# EAGLE design Atmega (EAGLE 6.3)
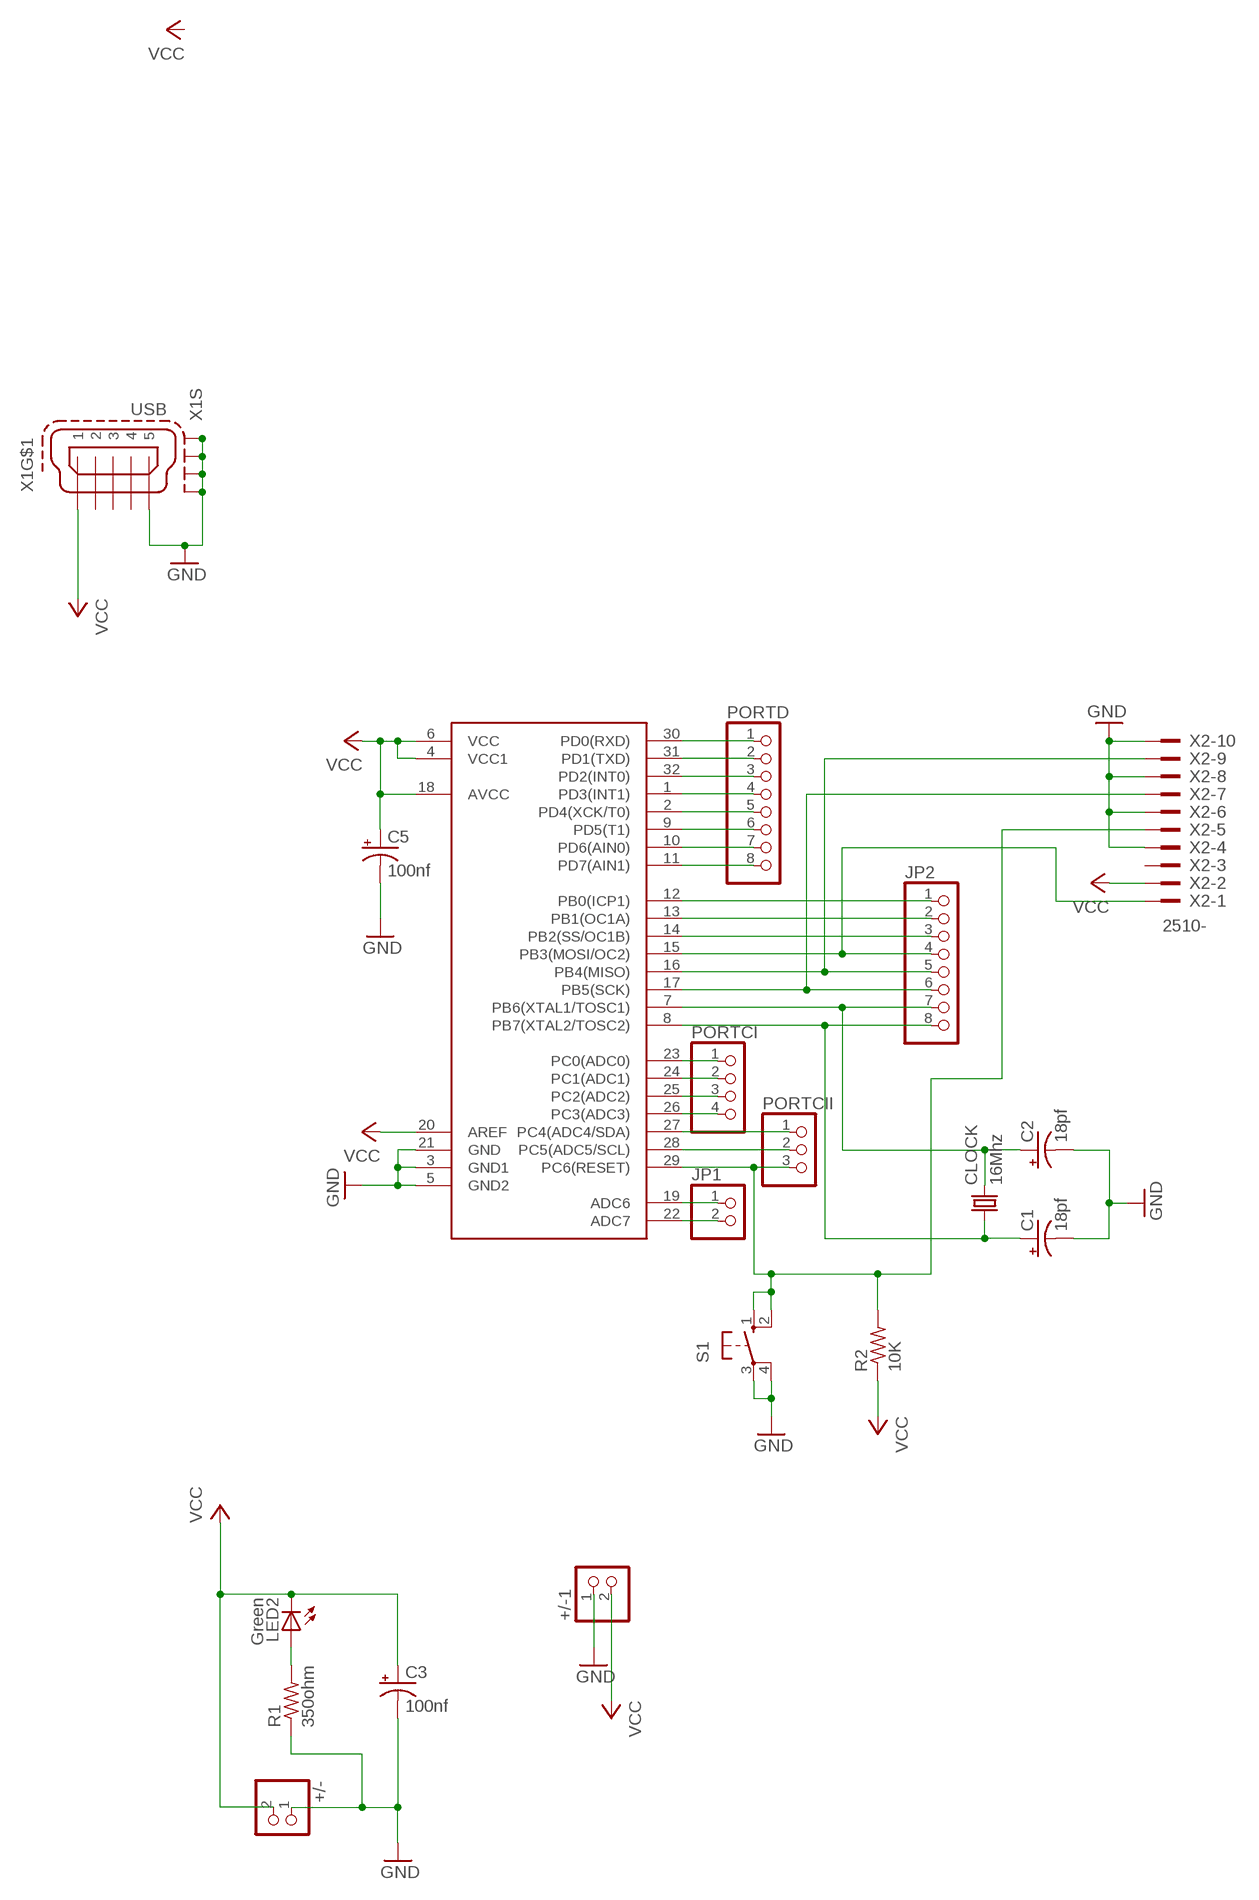
[diagram p0: schematic, sheet 1]

## Parts
+/-  PINHD-1X2  [1X02]
+/-1  PINHD-1X2  [1X02]
C1  18pf  CPOL-USSMCZ  [SMC_Z]
C2  18pf  CPOL-USSMCZ  [SMC_Z]
C3  100nf  CPOL-USSMCZ  [SMC_Z]
C5  100nf  CPOL-USSMCZ  [SMC_Z]
CLOCK  16Mhz  CRYSTALHC49UP  [HC49UP]
JP1  PINHD-1X2  [1X02]
JP2  PINHD-1X8  [1X08]
LED2  Green  LG_T679-E1F1-1  [PLCC2]
PORTCI  PINHD-1X4  [1X04]
PORTCII  PINHD-1X3  [1X03]
PORTD  PINHD-1X8  [1X08]
R1  350ohm  R-US_M0805  [M0805]
R2  10K  R-US_M0805  [M0805]
S1  10-XX  [B3F-10XX]
U$1  ATMEGA8A  [TQFP32-08]
X1  USB  MINI-USB-SCHIELD-32005-201  [32005-201]
X2  2510-  [PAK100/2500-10]

## Nets
GND: +/-1.1 +/-.1 C1.- C2.- C3.- C5.- R1.1 S1.3(P) S1.4(P1) U$1.3(GND1) U$1.5(GND2) U$1.21(GND) X1.5 X1.M1(S:S1) X1.M2(S:S2) X1.M3(S:S3) X1.M4(S:S4) X2.4 X2.6 X2.8 X2.10
N$4: LED2.A R1.2
N$5: PORTCI.1 U$1.23(PC0(ADC0))
N$6: PORTCI.2 U$1.24(PC1(ADC1))
N$8: PORTCI.3 U$1.25(PC2(ADC2))
N$9: PORTCI.4 U$1.26(PC3(ADC3))
N$10: PORTCII.1 U$1.27(PC4(ADC4/SDA))
N$11: PORTCII.2 U$1.28(PC5(ADC5/SCL))
N$12: PORTCII.3 R2.2 S1.1(S) S1.2(S1) U$1.29(PC6(RESET)) X2.5
N$13: JP2.1 U$1.12(PB0(ICP1))
N$14: JP2.2 U$1.13(PB1(OC1A))
N$15: JP2.3 U$1.14(PB2(SS/OC1B))
N$16: JP2.4 U$1.15(PB3(MOSI/OC2)) X2.1
N$17: JP2.5 U$1.16(PB4(MISO)) X2.9
N$18: JP2.6 U$1.17(PB5(SCK)) X2.7
N$19: C2.+ CLOCK.2 JP2.7 U$1.7(PB6(XTAL1/TOSC1))
N$20: C1.+ CLOCK.1 JP2.8 U$1.8(PB7(XTAL2/TOSC2))
N$22: PORTD.1 U$1.30(PD0(RXD))
N$23: PORTD.2 U$1.31(PD1(TXD))
N$25: PORTD.3 U$1.32(PD2(INT0))
N$26: PORTD.4 U$1.1(PD3(INT1))
N$27: PORTD.5 U$1.2(PD4(XCK/T0))
N$29: PORTD.6 U$1.9(PD5(T1))
N$30: PORTD.7 U$1.10(PD6(AIN0))
N$31: PORTD.8 U$1.11(PD7(AIN1))
N$32: JP1.1 U$1.19(ADC6)
N$33: JP1.2 U$1.22(ADC7)
VCC: +/-1.2 +/-.2 C3.+ C5.+ LED2.C R2.1 U$1.4(VCC1) U$1.6(VCC) U$1.18(AVCC) U$1.20(AREF) X1.1 X2.2
Unconnected: X1.2 X1.3 X1.4 X2.3

## Library data of the parts
+/- +/-1 JP1 = pinhead:PINHD-1X2: PIN HEADER
C1-C3 C5 = rcl:CPOL-US: POLARIZED CAPACITOR, American symbol
CLOCK = crystal:CRYSTAL: CRYSTAL; OC_FARNELL: unknown; OC_NEWARK: unknown
JP2 PORTD = pinhead:PINHD-1X8: PIN HEADER
LED2 = led:*_T679-?-1: LC TOPLED® Low Current LED Source: http://catalog.osram-os.com .. LG_LS_LY_T679_OBS.pdf; COLOR: green
PORTCI = pinhead:PINHD-1X4: PIN HEADER
PORTCII = pinhead:PINHD-1X3: PIN HEADER
R1 R2 = rcl:R-US_: RESISTOR, American symbol
S1 = switch-omron:10-XX: OMRON SWITCH; MPN: B3F-1000; OC_FARNELL: 176432; OC_NEWARK: 36M3542
U$1 = atmel:ATMEGA8A
X1 = con-cypressindustries:MINI-USB-SCHIELD-: MINI USB-B Conector Source: www.cypressindustries.com; OC_FARNELL: unknown; OC_NEWARK: unknown
X2 = con-3m:2510-: 3M (TM) Pak 100 4-Wall Header Source: 3M; MF: 3M; MPN: 2510-6002UB; OC_FARNELL: 9838244; OC_NEWARK: 46F4725

## Board
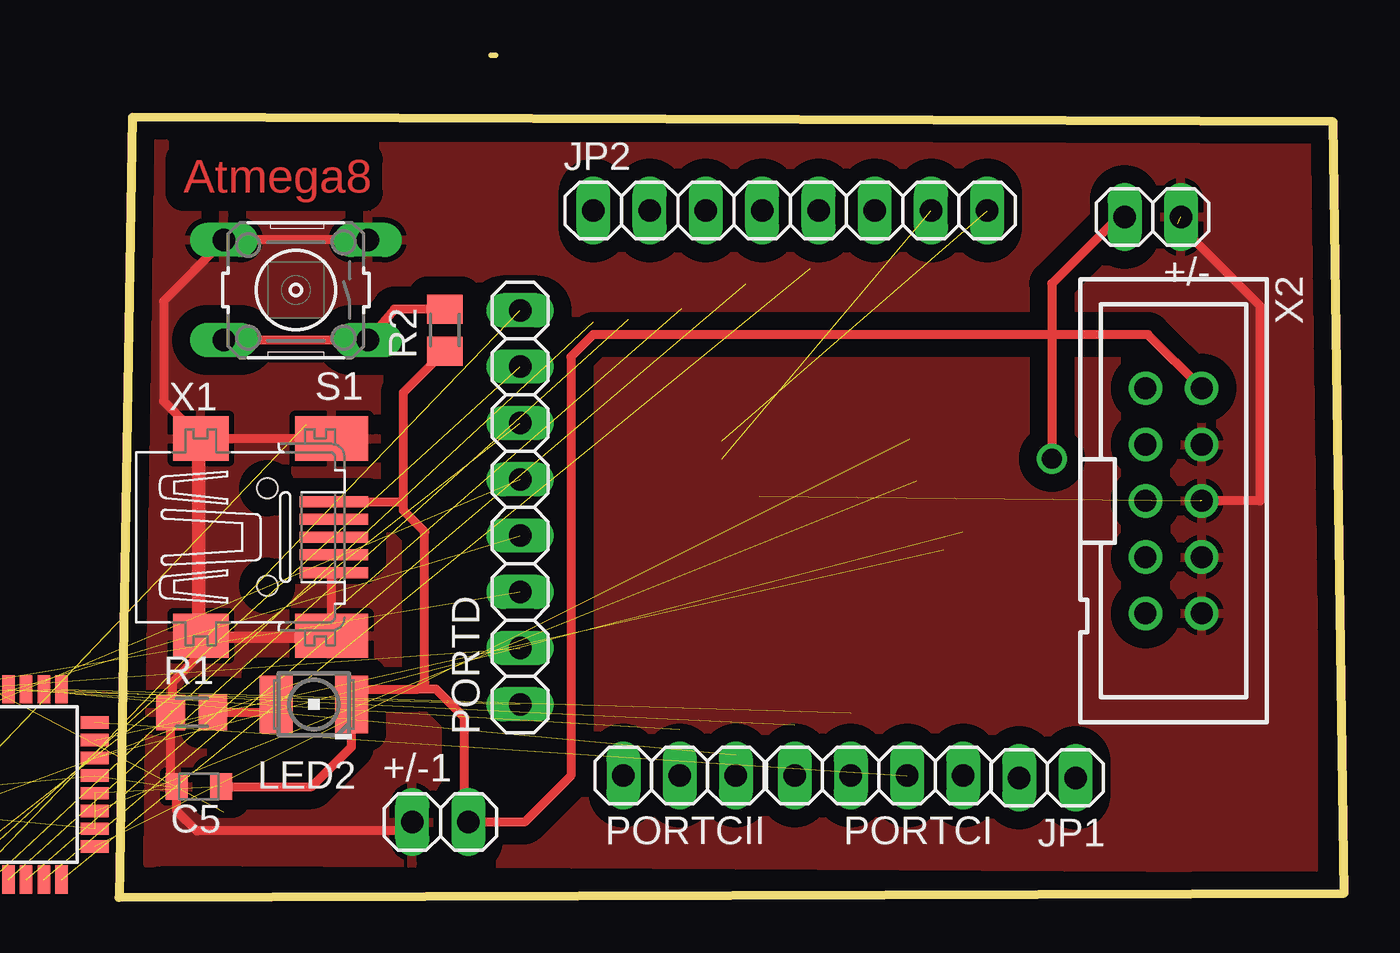
[diagram p1: board, top side]
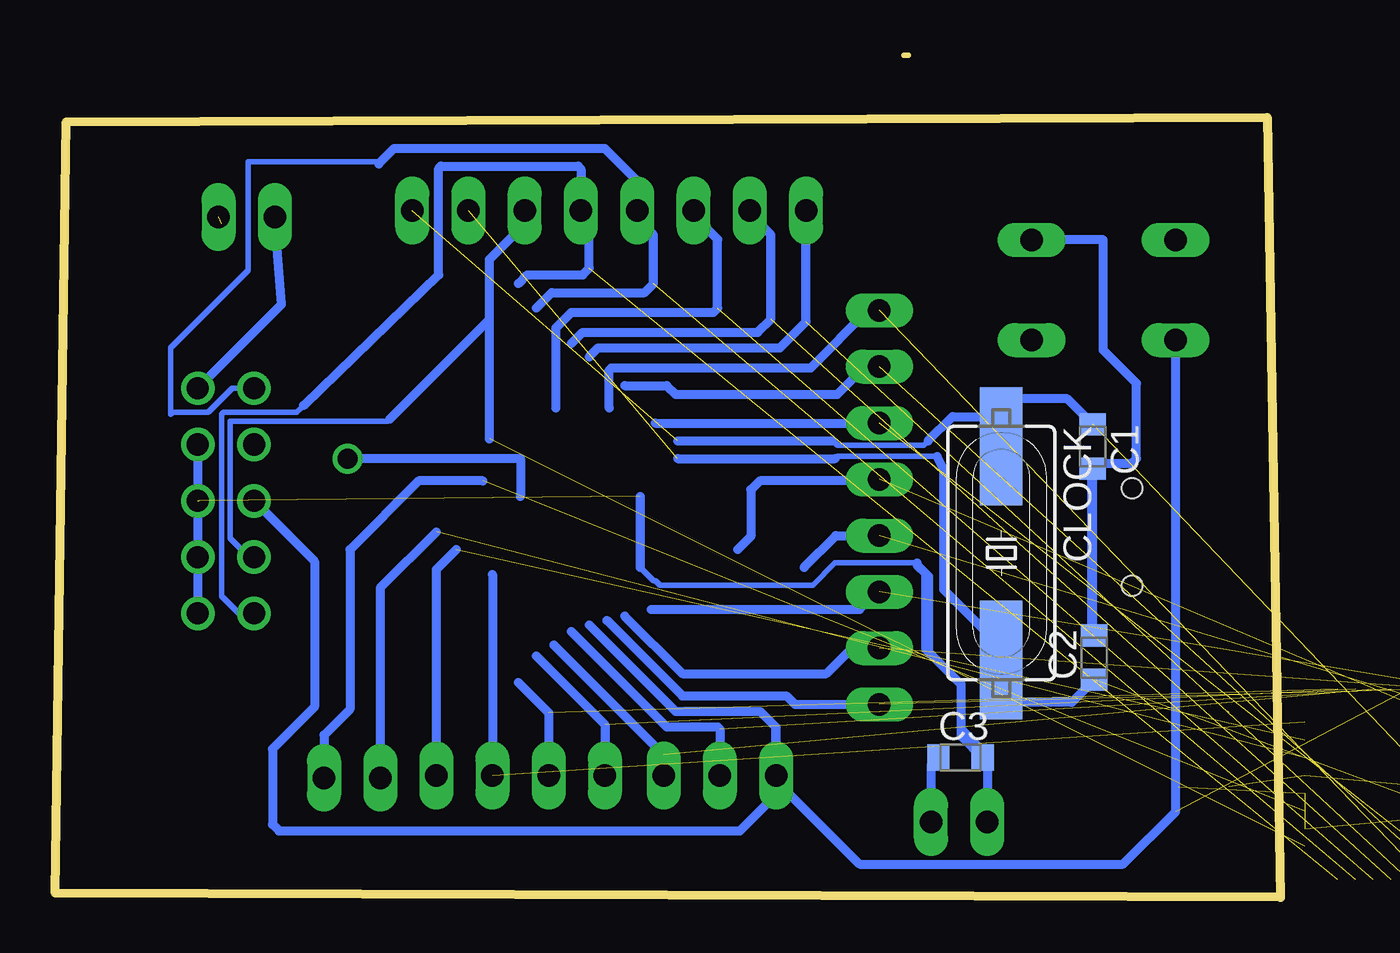
[diagram p2: board, bottom side, seen from below]

Size 55.3 x 38 mm. Coordinates in mm from the lower left corner, seen from the top.
Outline: 17,38 16.8,38
Outline: 0.6,35.2 0,0 55.3,0.2 54.8,35 0.6,35.2
Copper layers (1*16): Top 0.035mm / dielectric 1.5mm / Bottom 0.035mm
Design rules "default": minimum track width 10mil, minimum drill 24mil, track to track 4mil, track to pad 4mil, pad to pad 8mil, via to via 8mil, smd to smd 8mil, copper to edge 10mil, drill to drill 8mil, minimum pad ring 10mil, minimum via ring 8mil, stop-mask expansion 4mil, vias tented up to drill 0mil, thermal gap 10mil

### Footprints (pad centres in the part's own frame; a part is rotated, then mirrored left to right if it is on the bottom)
1X02 = drill 1.016 long: 1 -1.27,0; 2 1.27,0
SMC_Z = smd 1 x 1.2: + -1,0; - 1,0
HC49UP = smd 5.334 x 1.93: 1 -4.826,0; 2 4.826,0
1X08 = drill 1.016 long: 1 -8.89,0; 2 -6.35,0; 3 -3.81,0; 4 -1.27,0; 5 1.27,0; 6 3.81,0; 7 6.35,0; 8 8.89,0
PLCC2 = smd 2.6 x 1.5: A 0,1.7; C 0,-1.7
1X04 = drill 1.016 long: 1 -3.81,0; 2 -1.27,0; 3 1.27,0; 4 3.81,0
1X03 = drill 1.016 long: 1 -2.54,0; 2 0,0; 3 2.54,0
M0805 = smd 1.3 x 1.6: 1 -0.95,0; 2 0.95,0
B3F-10XX = drill 1.016 long: 1 -3.251,2.261; 2 3.251,2.261; 3 -3.251,-2.261; 4 3.251,-2.261
TQFP32-08 = smd 1.27 x 0.559: 1 -4.293,2.8; 2 -4.293,2; 3 -4.293,1.2; 4 -4.293,0.4; 5 -4.293,-0.4; 6 -4.293,-1.2; 7 -4.293,-2; 8 -4.293,-2.8; 17 4.293,-2.8; 18 4.293,-2; 19 4.293,-1.2; 20 4.293,-0.4; 21 4.293,0.4; 22 4.293,1.2; 23 4.293,2; 24 4.293,2.8 | smd 0.559 x 1.27: 9 -2.8,-4.293; 10 -2,-4.293; 11 -1.2,-4.293; 12 -0.4,-4.293; 13 0.4,-4.293; 14 1.2,-4.293; 15 2,-4.293; 16 2.8,-4.293; 25 2.8,4.293; 26 2,4.293; 27 1.2,4.293; 28 0.4,4.293; 29 -0.4,4.293; 30 -1.2,4.293; 31 -2,4.293; 32 -2.8,4.293
32005-201 = smd 3.1 x 0.5: 1 3,1.6; 2 3,0.8; 3 3,0; 4 3,-0.8; 5 3,-1.6 | smd 2.5 x 2: M1 -3,-4.45; M2 -3,4.45 | smd 3.3 x 2: M3 2.9,4.45; M4 2.9,-4.45 | hole 0.9: 0,2.2; 0,-2.2
PAK100/2500-10 = drill 1 pad 1.422: 1 -5.08,-1.27; 2 -5.08,1.27; 3 -2.54,-1.27; 4 -2.54,1.27; 5 0,-1.27; 6 0,1.27; 7 2.54,-1.27; 8 2.54,1.27; 9 5.08,-1.27; 10 5.08,1.27

### Placement (x,y rotation side)
+/-  46.66,30.71 180 top
+/-1  14.5,3.4 0 top
C1  8.47,20.35 270 bottom
C2  8.4,10.82 90 bottom
C3  14.44,6.31 0 bottom
C5  3.6,5 180 top
CLOCK  12.6,15.54 270 bottom
JP1  41.9,5.4 180 top
JP2  30.3,31 0 top
LED2  8.79,8.71 90 top
PORTCI  34.3,5.5 180 top
PORTCII  25.3,5.5 180 top
PORTD  18.1,17.6 90 top
R1  3.28,8.35 0 top
R2  14.7,25.6 90 top
S1  7.98,27.41 180 top
U$1  -5.4,5.1 0 top
X1  6.69,16.26 0 top
X2  47.6,17.9 270 top

### Tracks (layer width: path | path; a pad name or v marks a point on that pad's centre or on a via)
GND  (7 unrouted)
  Top 0.406: X1.M3 X1.M2 | X1.M1 X1.M4 | X1.M4 9.59,14.56 X1.5 | X1.M1 3.69,11.69 | 3.69,11.69 3.69,10.99 2.4,9.7 2.4,8.42 | X1.M2 X1.M1 | 3.69,11.69 3.5,11.5 3.5,20.5 3,21 3.4,21 X1.M2 | 3.69,11.69 9.47,11.69 X1.M4 | R1.1 2.33,5 C5.- 2.6,3.9 3.5,3 12.83,3 +/-1.1 | S1.3 S1.4 4.73,29.63 2,26.9 2,22.4 X1.M2 | 47.8,30.4 51.5,26.7 51.5,17.9 48.8,17.9
  Bottom 0.254: 28.9,14.9 28.3,14.3 28.2,14.3 28,14.1 21.1,14.1 20.1,15.1 16.4,15.1 15.8,14.5 15.8,10.9 14.4,9.5 14.4,7.7 13.44,6.74 C3.-
  Bottom 0.406: X2.4 X2.6 X2.8 X2.10 | 28.9,18.1 28.9,14.9 | 16.4,15.1 16.4,15 16,14.6 16,11.2 14.4,9.6 14.4,7.27 C3.- 13.23,6.1 +/-1.1 | C2.- 8.47,11.89 | 8.47,11.89 C1.- | 8.47,11.89 8.5,11.92 8.5,19.3 8.2,19.6 6.7,19.6 6.5,19.8 6.5,23.2 8,24.7 8,29.67 S1.3
  pour Top (isolate 0.813): 2.2,33.9 53.9,33.9 53.9,1.2 53.8,1.3 1.8,1.6 1.3,1.5 1.6,34.5
N$4
  Top 0.406: R1.2 6.73,8.35 LED2.A
N$5  (1 unrouted)
  Bottom 0.406: 37.2,15.7 38.11,14.79 PORTCI.1
N$6  (1 unrouted)
  Bottom 0.406: 35.57,14.58 PORTCI.2
N$8  (1 unrouted)
  Bottom 0.406: 34.4,9.7 33.03,8.33 PORTCI.3
N$9  (1 unrouted)
  Bottom 0.406: 33.6,10.9 30.49,7.79 PORTCI.4
N$10  (1 unrouted)
  Bottom 0.406: 32.8,11.4 27.84,6.44 PORTCII.1
N$11  (1 unrouted)
  Bottom 0.406: 32,12 27.7,7.7 25.4,7.7 25.3,7.6 PORTCII.2
N$12  (1 unrouted)
  Top 0.406: S1.2 S1.1 12.43,26.55 R2.2
  Bottom 0.406: 31.2,12.3 27.3,8.4 23.5,8.4 22.8,7.7 | 22.8,7.7 22.76,7.66 PORTCII.3 22.76,4.64 24.4,3 45.2,3 45.5,3.3 45.5,6.7 43.6,8.6 43.6,15.17 X2.5 | 22.8,7.7 22.8,5.3 19,1.5 7.1,1.5 4.73,3.87 S1.2
N$13  (1 unrouted)
  Bottom 0.406: 31.2,24.4 30.8,24.8 22.6,24.8 21.41,25.99 JP2.1
N$14  (1 unrouted)
  Bottom 0.406: 32,25 31.5,25.5 23.6,25.5 23,26.1 23,29.9 23.95,30.85 JP2.2
N$15  (1 unrouted)
  Bottom 0.406: 32.7,22.09 32.7,25.7 32,26.4 25.6,26.4 25.4,26.6 25.4,29.7 26.49,30.79 JP2.3
N$16  (1 unrouted)
  Bottom 0.254: 40.7,33.1 40.8,33.2 46.6,33.2 46.6,28.3 50.1,24.8 50.1,21.8 50,21.9 48.4,21.9 47.32,22.98 X2.1 46.62,22.98 45.8,22.8
  Bottom 0.406: 33.6,26.6 32.9,27.3 28.7,27.3 28.3,27.7 28.3,29.9 29.03,30.63 JP2.4 29.03,32.33 30.5,33.8 40,33.8 40.7,33.1
N$17  (1 unrouted)
  Bottom 0.254: 44.1,22.2 44.4,21.9 47.7,21.9 47.8,21.8 47.8,13.6 47.02,12.82 X2.9
  Bottom 0.406: 34.4,27.7 34,28.1 31.5,28.1 31.2,28.4 31.2,29.8 31.57,30.17 JP2.5 31.57,32.87 31.7,33 37.9,33 38,32.9 38,28.1 44.1,22.2
N$18  (1 unrouted)
  Bottom 0.254: 40.2,21.6 40.3,21.5 47.4,21.5 47.4,16.2 46.56,15.36 X2.7
  Bottom 0.406: 35.7,20.69 35.7,26.1 | JP2.6 34.11,30.39 35.7,28.8 35.7,26.1 | X2.7 46.2,15.49 46.2,15.5 | 40.2,21.6 35.7,26.1
N$19  (2 unrouted)
  Bottom 0.254: 20.1,19.8 20,19.9 15.5,19.9
  Bottom 0.406: 27.21,19.8 20.1,19.8 | 15.5,19.9 15.2,19.3 15.2,13.9 12.6,11.3 CLOCK.2 12.6,9.3 12.1,8.8 9.42,8.8 C2.+
N$20  (2 unrouted)
  Bottom 0.254: 20.2,20.6 20,20.4 16.1,20.4 15.9,20.6
  Bottom 0.406: 27.21,20.6 20.2,20.6 | 12.6,21.7 14.8,21.7 15.9,20.6 | 12.6,21.7 CLOCK.1 | C1.+ 9.62,22.5 12.6,22.5 12.6,21.7
N$22  (1 unrouted)
  Bottom 0.406: 30.4,12.5 27,9.1 22.3,9.1 21.91,8.71 PORTD.1
N$23  (1 unrouted)
  Bottom 0.406: 29.6,12.7 27,10.1 20.5,10.1 19.35,11.25 PORTD.2
N$25  (1 unrouted)
  Bottom 0.406: 28.39,13 19,13 18.21,13.79 PORTD.3
N$26  (1 unrouted)
  Bottom 0.406: 21.5,14.9 20.07,16.33 PORTD.4
N$27  (1 unrouted)
  Bottom 0.406: PORTD.5 18.17,18.8 23.5,18.8 23.9,18.4 23.9,16.3 24.5,15.7
N$29  (1 unrouted)
  Bottom 0.406: 28.22,21.41 PORTD.6
N$30  (1 unrouted)
  Bottom 0.406: 29.6,23.1 27.7,23.1 27.3,22.7 20,22.7 18.75,23.95 PORTD.7
N$31  (1 unrouted)
  Bottom 0.406: 30.3,22.09 30.3,23.8 30.2,23.9 21.2,23.9 18.61,26.49 PORTD.8
N$32  (1 unrouted)
  Bottom 0.406: 35.99,18.8 38.9,18.8 42,15.7 42,8.5 43.17,7.33 JP1.1
N$33  (1 unrouted)
  Bottom 0.406: 38.1,16.5 40.63,13.97 JP1.2
VCC  (via drill 0.9)  (4 unrouted)
  Top 0.406: X1.1 12.84,17.86 | 12.84,17.86 12.84,22.79 R2.1 | 13.5,9.4 11.18,9.4 LED2.C 10.49,6.79 8.7,5 C5.+ | 13.5,9.4 13.8,9.7 13.8,16.5 12.84,17.46 12.84,17.86 | 13.5,9.4 14.3,9.4 15.6,8.1 15.6,3.57 +/-1.2 18.3,3.4 20.4,5.5 20.4,24.4 21.4,25.4 42.1,25.4 | X2.2 46.45,25.4 42.1,25.4 | 42.1,25.4 v42.1,19.8 | 45.3,30.9 42.1,27.7 42.1,25.4
  Bottom 0.406: 34.3,18.1 34.3,19.8 v42.1,19.8 | C3.+ 15.77,5.98 +/-1.2 | X2.2 45.09,26.76 +/-.2

### Text on the board
Top: Atmega8